# EAGLE design Coffee_Roaster_V2.0_Final_2025_02_24_A (EAGLE 9.6.1)

## Sheet 1 of 2
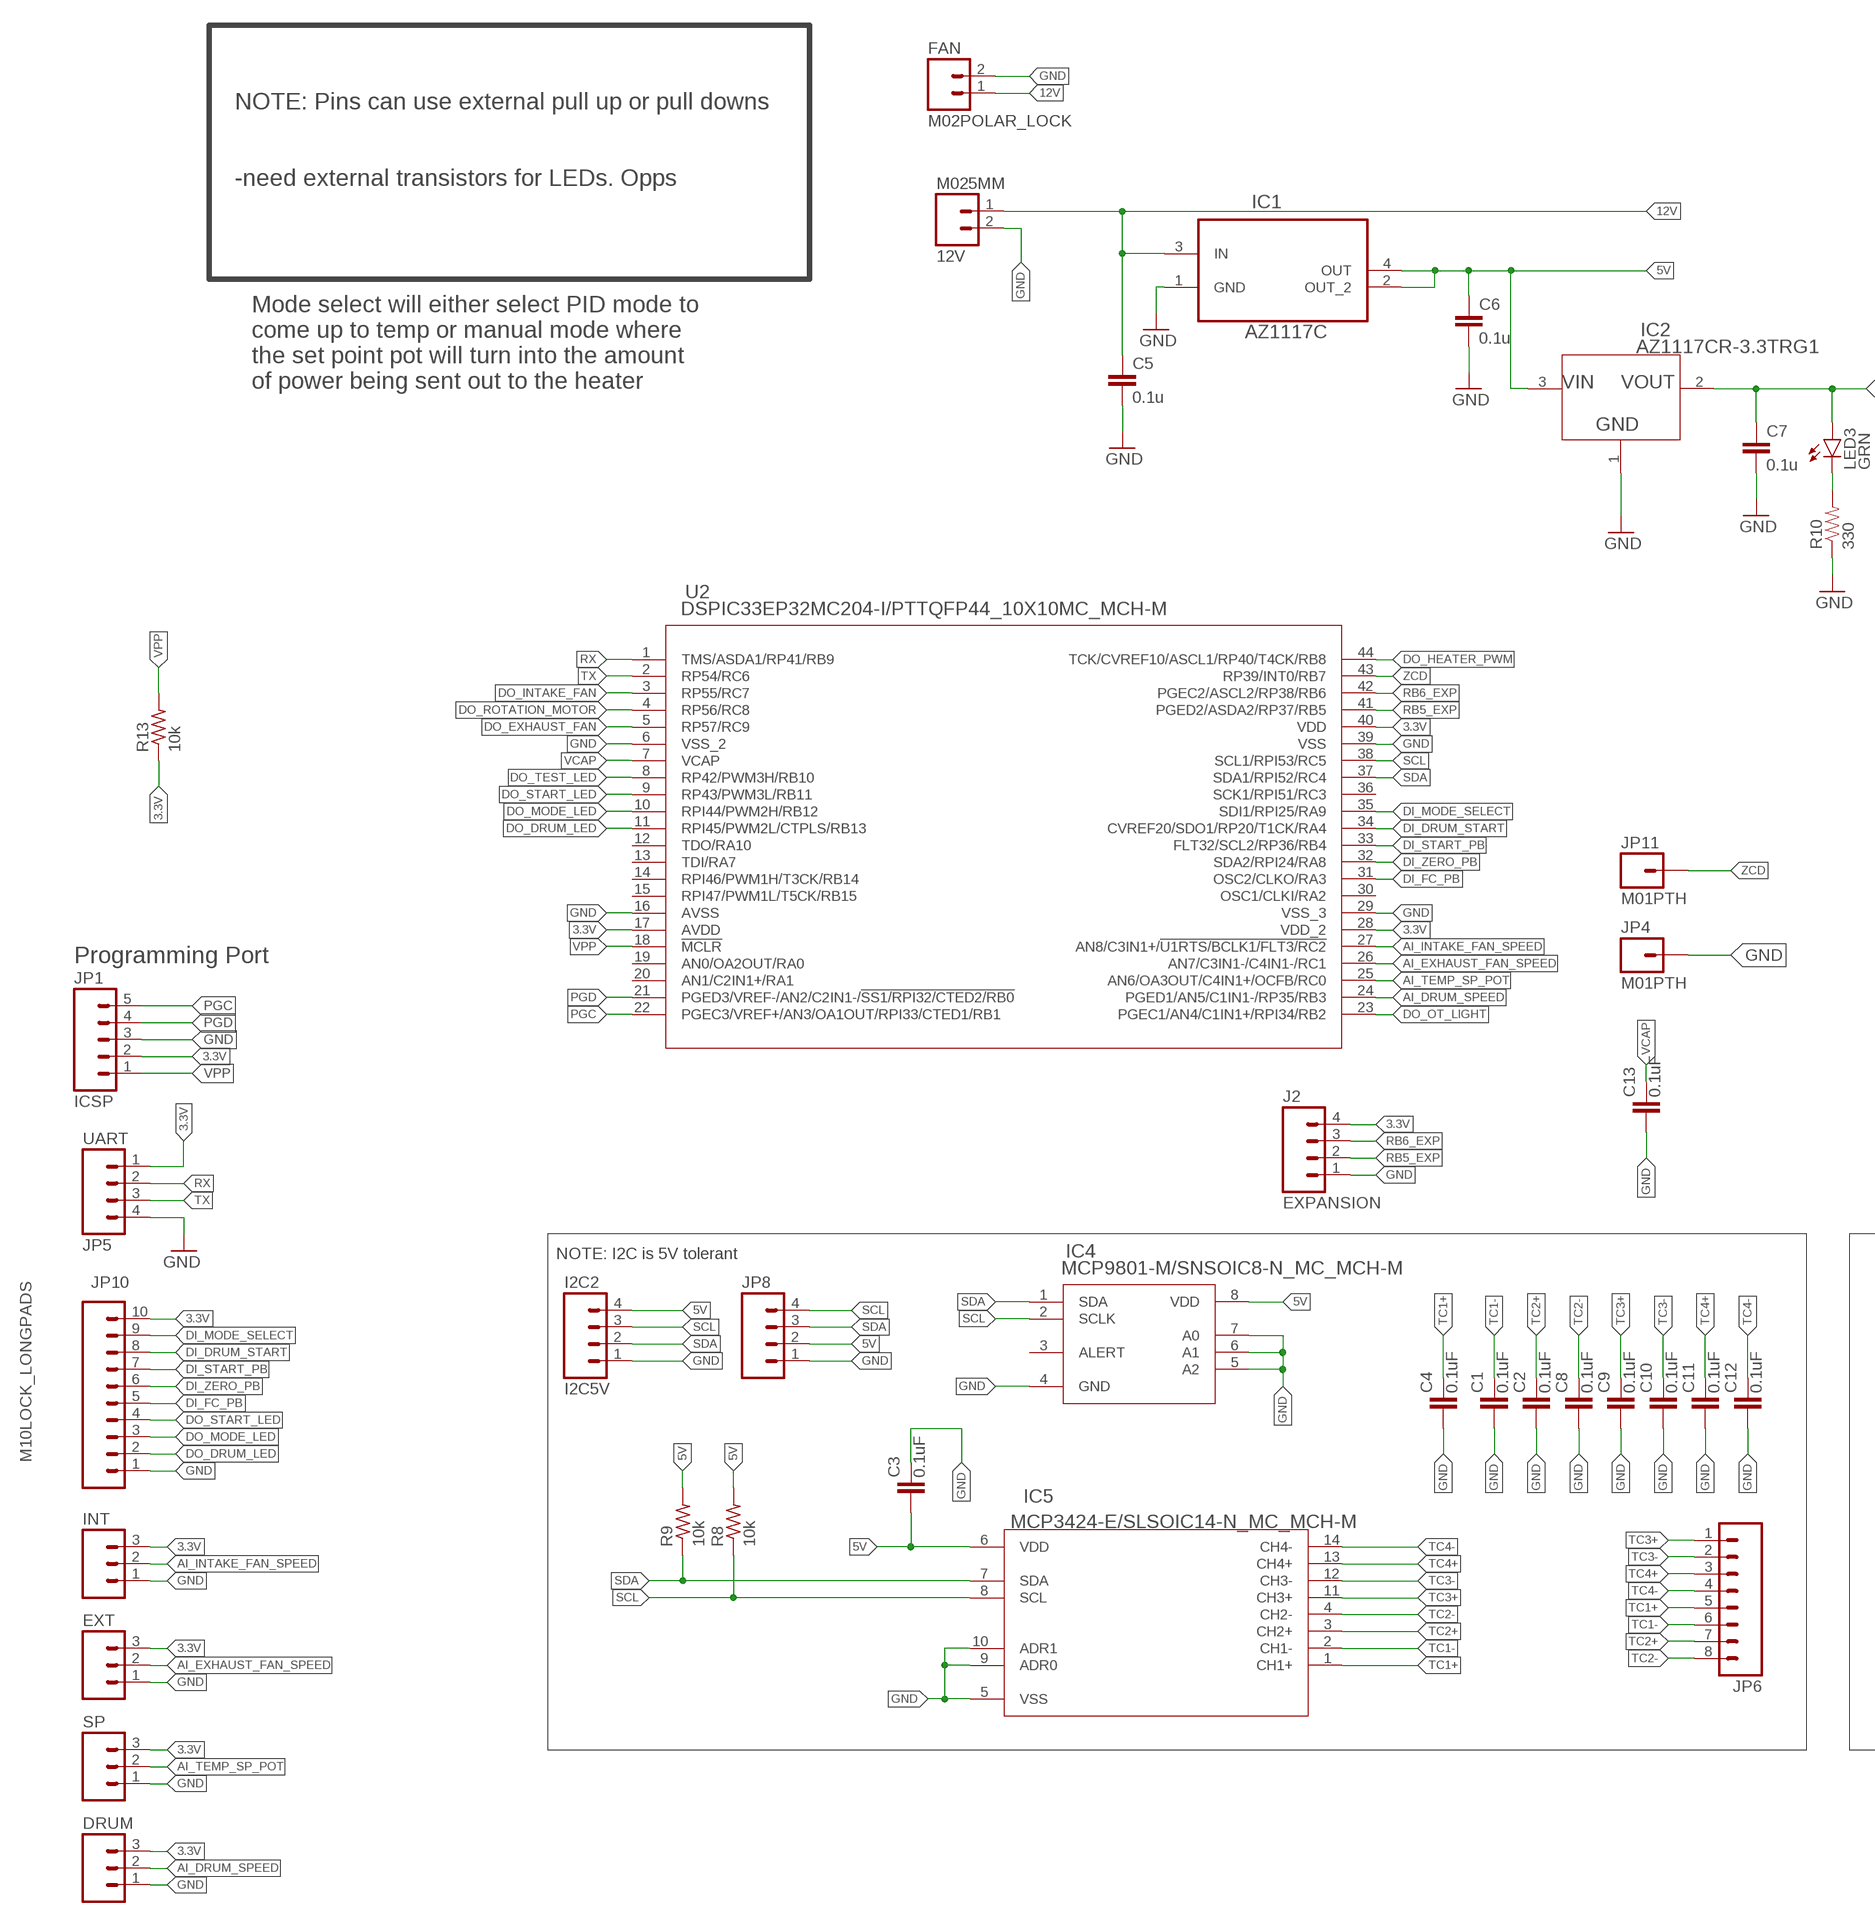
[diagram p0: schematic, sheet 1, part 1 of 2]
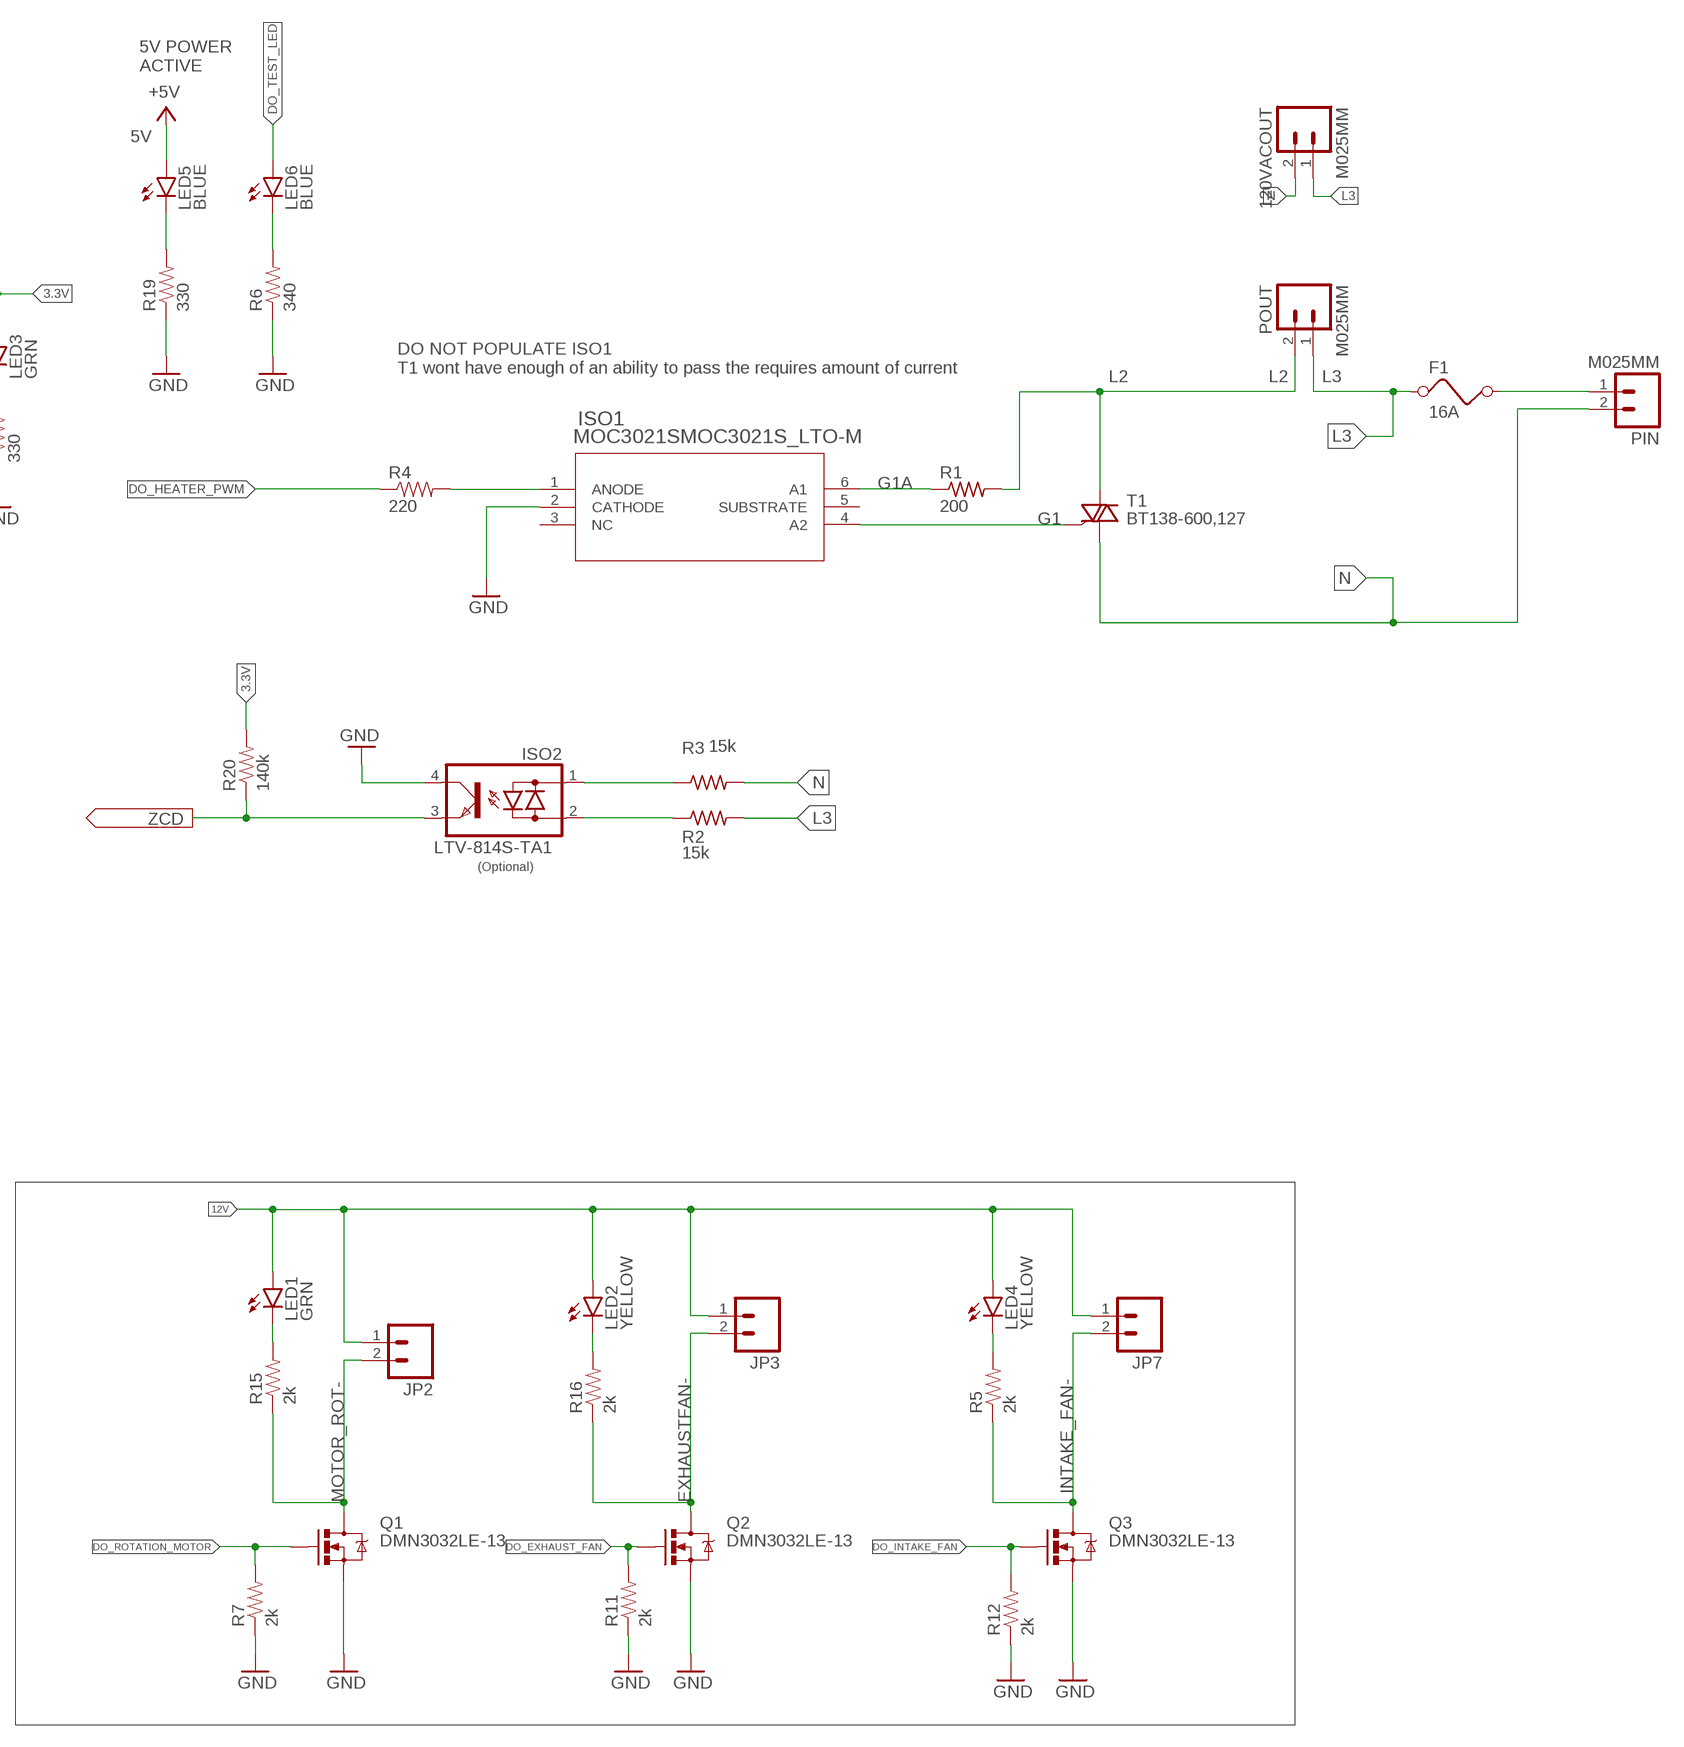
[diagram p1: schematic, sheet 1, part 2 of 2]

### Parts
12V  M025MM  [SCREWTERMINAL-5MM-2]
120VACOUT  M025MM  [SCREWTERMINAL-5MM-2]
C1  0.1uF  CAP0805  [0805]
C2  0.1uF  CAP0805  [0805]
C3  0.1uF  CAP0805  [0805]
C4  0.1uF  CAP0805  [0805]
C5  0.1u  CAP1206  [1206]
C6  0.1u  CAP1206  [1206]
C7  0.1u  CAP1206  [1206]
C8  0.1uF  CAP0805  [0805]
C9  0.1uF  CAP0805  [0805]
C10  0.1uF  CAP0805  [0805]
C11  0.1uF  CAP0805  [0805]
C12  0.1uF  CAP0805  [0805]
C13  0.1uF  CAP0805  [0805]
DRUM  M03POLAR_LOCK  [MOLEX-1X3_LOCK]
EXT  M03POLAR_LOCK  [MOLEX-1X3_LOCK]
F1  16A  FUSE  [FUSE]
FAN  M02POLAR_LOCK  [MOLEX-1X2_LOCK]
I2C2  I2C5V  M04JST  [1X04-1.5MM_JST]
IC1  AZ1117C  ADP3338AKCZ-5-R7  [SOT230P700X180-4N]
IC2  AZ1117CR-3.3TRG1  [SOT89_AZ1117_DIO]
IC4  MCP9801-M/SNSOIC8-N_MC_MCH-M  [SOIC8-N_MC_MCH-M]
IC5  MCP3424-E/SLSOIC14-N_MC_MCH-M  [SOIC14-N_MC_MCH-M]
INT  M03POLAR_LOCK  [MOLEX-1X3_LOCK]
ISO1  MOC3021SMOC3021S_LTO-M  [MOC3021S_LTO-M]
ISO2  LTV-814S-TA1  SFH6206  [DIL4-SMD]
J2  EXPANSION  M04JST  [1X04-1.5MM_JST]
JP1  ICSP  M05PTH  [1X05]
JP2  M02POLAR_LOCK  [MOLEX-1X2_LOCK]
JP3  M02POLAR_LOCK  [MOLEX-1X2_LOCK]
JP4  M01PTH  [1X01]
JP5  UART  M04LOCK  [1X04_LOCK]
JP6  M083.5MM-8  [SCREWTERMINAL-3.5MM-8]
JP7  M02POLAR_LOCK  [MOLEX-1X2_LOCK]
JP8  M04LOCK_LONGPADS  [1X04_LOCK_LONGPADS]
JP10  M10LOCK_LONGPADS  [1X10_LOCK_LONGPADS]
JP11  M01PTH  [1X01]
LED1  GRN  LED1206  [LED-1206]
LED2  YELLOW  LED1206  [LED-1206]
LED3  GRN  LED1206  [LED-1206]
LED4  YELLOW  LED1206  [LED-1206]
LED5  BLUE  LED1206  [LED-1206]
LED6  BLUE  LED1206  [LED-1206]
PIN  M025MM  [SCREWTERMINAL-5MM-2]
POUT  M025MM  [SCREWTERMINAL-5MM-2]
Q1  DMN3032LE-13  NFET_SOT_223  [SOT223]
Q2  DMN3032LE-13  NFET_SOT_223  [SOT223]
Q3  DMN3032LE-13  NFET_SOT_223  [SOT223]
R1  200  R-US_R2512  [R2512]
R2  15k  R-US_R2512  [R2512]
R3  15k  R-US_R2512  [R2512]
R4  220  RESISTOR1206  [1206]
R5  2k  RESISTOR1206  [1206]
R6  340  RESISTOR1206  [1206]
R7  2k  RESISTOR1206  [1206]
R8  10k  R-US_M0805  [M0805]
R9  10k  R-US_M0805  [M0805]
R10  330  RESISTOR1206  [1206]
R11  2k  RESISTOR1206  [1206]
R12  2k  RESISTOR1206  [1206]
R13  10k  R-US_M0805  [M0805]
R15  2k  RESISTOR1206  [1206]
R16  2k  RESISTOR1206  [1206]
R19  330  RESISTOR1206  [1206]
R20  140k  RESISTOR1206  [1206]
SP  M03POLAR_LOCK  [MOLEX-1X3_LOCK]
T1  BT138-600,127  BT138-V  [TO220BV]
U2  DSPIC33EP32MC204-I/PTTQFP44_10X10MC_MCH-M  [TQFP44_10X10MC_MCH-M]

### Nets
3.3V: C7.1 DRUM.3 EXT.3 IC2.2(OUTPUT) INT.3 J2.4 JP1.2 JP5.1 JP10.10 LED3.A R13.1 R20.2 SP.3 U2.17(AVDD) U2.28(VDD_2) U2.40(VDD)
5V: C3.1 C6.1 I2C2.4 IC1.2(OUT_2) IC1.4(OUT) IC2.3(INPUT) IC4.8(VDD) IC5.6(VDD) JP8.2 LED5.A R8.2 R9.2 ; supply symbol labelled +5V
12V: 12V.1 C5.1 FAN.1 IC1.3(IN) JP2.1 JP3.1 JP7.1 LED1.A LED2.A LED4.A
AI_DRUM_SPEED: DRUM.2 U2.24(PGED1/AN5/C1IN1-/RP35/RB3)
AI_EXHAUST_FAN_SPEED: EXT.2 U2.26(AN7/C3IN1-/C4IN1-/RC1)
AI_INTAKE_FAN_SPEED: INT.2 U2.27(AN8/C3IN1+/!U1RTS/BCLK1/FLT3/RC2)
AI_TEMP_SP_POT: SP.2 U2.25(AN6/OA3OUT/C4IN1+/OCFB/RC0)
DI_DRUM_START: JP10.8 U2.34(CVREF20/SDO1/RP20/T1CK/RA4)
DI_FC_PB: JP10.5 U2.31(OSC2/CLKO/RA3)
DI_MODE_SELECT: JP10.9 U2.35(SDI1/RPI25/RA9)
DI_START_PB: JP10.7 U2.33(FLT32/SCL2/RP36/RB4)
DI_ZERO_PB: JP10.6 U2.32(SDA2/RPI24/RA8)
DO_DRUM_LED: JP10.2 U2.11(RPI45/PWM2L/CTPLS/RB13)
DO_EXHAUST_FAN: Q2.1(G) R11.2 U2.5(RP57/RC9)
DO_HEATER_PWM: R4.1 U2.44(TCK/CVREF10/ASCL1/RP40/T4CK/RB8)
DO_INTAKE_FAN: Q3.1(G) R12.2 U2.3(RP55/RC7)
DO_MODE_LED: JP10.3 U2.10(RPI44/PWM2H/RB12)
DO_OT_LIGHT: U2.23(PGEC1/AN4/C1IN1+/RPI34/RB2)
DO_ROTATION_MOTOR: Q1.1(G) R7.2 U2.4(RP56/RC8)
DO_START_LED: JP10.4 U2.9(RP43/PWM3L/RB11)
DO_TEST_LED: LED6.A U2.8(RP42/PWM3H/RB10)
EXHAUSTFAN-: JP3.2 Q2.2(D) Q2.4(D) R16.1
G1: ISO1.4(A2) T1.G
G1A: ISO1.6(A1) R1.1
GND: 12V.2 C1.1 C2.1 C3.2 C4.1 C5.2 C6.2 C7.2 C8.1 C9.1 C10.1 C11.1 C12.1 C13.1 DRUM.1 EXT.1 FAN.2 I2C2.1 IC1.1(GND) IC2.1(ADJ/GND) IC4.4(GND) IC4.5(A2) IC4.6(A1) IC4.7(A0) IC5.5(VSS) IC5.9(ADR0) IC5.10(ADR1) INT.1 ISO1.2(CATHODE) ISO2.4(C) J2.1 JP1.3 JP4.1 JP5.4 JP8.1 JP10.1 Q1.3(S) Q2.3(S) Q3.3(S) R6.1 R7.1 R10.1 R11.1 R12.1 R19.1 SP.1 U2.6(VSS_2) U2.16(AVSS) U2.29(VSS_3) U2.39(VSS)
INTAKE_FAN-: JP7.2 Q3.2(D) Q3.4(D) R5.1
L1: F1.2 PIN.1
L2: POUT.2 R1.2 T1.T2(A2)
L3: 120VACOUT.1 F1.1 POUT.1 R2.2
MOTOR_ROT-: JP2.2 Q1.2(D) Q1.4(D) R15.1
N: 120VACOUT.2 PIN.2 R3.2 T1.T1(A1)
N$1: ISO1.1(ANODE) R4.2
N$2: LED3.C R10.2
N$3: LED1.C R15.2
N$4: LED2.C R16.2
N$6: ISO2.1(AC1) R3.1
N$7: ISO2.2(AC2) R2.1
N$8: LED4.C R5.2
N$10: LED6.C R6.2
N$13: LED5.C R19.2
PGC: JP1.5 U2.22(PGEC3/VREF+/AN3/OA1OUT/RPI33/CTED1/RB1)
PGD: JP1.4 U2.21(PGED3/VREF-/AN2/C2IN1-/!SS1/RPI32/CTED2/RB0)
RB5_EXP: J2.2 U2.41(PGED2/ASDA2/RP37/RB5)
RB6_EXP: J2.3 U2.42(PGEC2/ASCL2/RP38/RB6)
RX: JP5.2 U2.1(TMS/ASDA1/RP41/RB9)
SCL: I2C2.3 IC4.2(SCLK) IC5.8(SCL) JP8.4 R8.1 U2.38(SCL1/RPI53/RC5)
SDA: I2C2.2 IC4.1(SDA) IC5.7(SDA) JP8.3 R9.1 U2.37(SDA1/RPI52/RC4)
TC1+: C4.2 IC5.1(CH1+) JP6.5
TC1-: C1.2 IC5.2(CH1-) JP6.6
TC2+: C2.2 IC5.3(CH2+) JP6.7
TC2-: C8.2 IC5.4(CH2-) JP6.8
TC3+: C9.2 IC5.11(CH3+) JP6.1
TC3-: C10.2 IC5.12(CH3-) JP6.2
TC4+: C11.2 IC5.13(CH4+) JP6.3
TC4-: C12.2 IC5.14(CH4-) JP6.4
TX: JP5.3 U2.2(RP54/RC6)
VCAP: C13.2 U2.7(VCAP)
VPP: JP1.1 R13.2 U2.18(!MCLR)
ZCD: ISO2.3(E) JP11.1 R20.1 U2.43(RP39/INT0/RB7)
Unconnected: IC4.3(ALERT) ISO1.3(NC) ISO1.5(SUBSTRATE) U2.12(TDO/RA10) U2.13(TDI/RA7) U2.14(RPI46/PWM1H/T3CK/RB14) U2.15(RPI47/PWM1L/T5CK/RB15) U2.19(AN0/OA2OUT/RA0) U2.20(AN1/C2IN1+/RA1) U2.30(OSC1/CLKI/RA2) U2.36(SCK1/RPI51/RC3)

### Notes on the sheet
- 5V POWER
  ACTIVE
- NOTE: Pins can use external pull up or pull downs
  
  
  -need external transistors for LEDs. Opps
- Mode select will either select PID mode to
  come up to temp or manual mode where
  the set point pot will turn into the amount
  of power being sent out to the heater
- DO NOT POPULATE ISO1
  T1 wont have enough of an ability to pass the requires amount of current
- (Optional)
- Programming Port
- NOTE: I2C is 5V tolerant

## Sheet 2 of 2

## Library data of the parts
12V 120VACOUT PIN POUT = SparkFun-Connectors:M02: Standard 2-pin 0.1" header. Use with - straight break away headers ( PRT-00116) - right angle break away headers (PRT-00553) - swiss pins (PRT-00743) - machine pins (PRT-00117) - female headers (PRT-00115) Molex polarized connector foot print use with: PRT-08233 with associated crimp pins and housings. 2.54_SCREWTERM for use with PRT-10571. 3.5mm Screw Terminal footprints for PRT-08084 5mm Screw Terminal footprints for use with PRT-08432; STOREFRONT_ID: PRT-08432
C1-C4 C8-C13 = SparkFun-Capacitors:CAP: Capacitor Standard 0603 ceramic capacitor, and 0.1" leaded capacitor.
C5-C7 = SparkFun:CAP: Capacitor Standard 0603 ceramic capacitor, and 0.1" leaded capacitor.
DRUM EXT INT SP = SparkFun-Connectors:M03: Header 3 Standard 3-pin 0.1" header. Use with straight break away headers (SKU : PRT-00116), right angle break away headers (PRT-00553), swiss pins (PRT-00743), machine pins (PRT-00117), and female headers (PRT-00115). Molex polarized connector foot print use with SKU : PRT-08232 with associated crimp pins and housings.
F1 = special:FUSE: FUSE 5 x 20 mm
FAN = SparkFun-Connectors:M02: Standard 2-pin 0.1" header. Use with - straight break away headers ( PRT-00116) - right angle break away headers (PRT-00553) - swiss pins (PRT-00743) - machine pins (PRT-00117) - female headers (PRT-00115) Molex polarized connector foot print use with: PRT-08233 with associated crimp pins and housings. 2.54_SCREWTERM for use with PRT-10571. 3.5mm Screw Terminal footprints for PRT-08084 5mm Screw Terminal footprints for use with PRT-08432
I2C2 J2 JP5 JP8 = SparkFun-Connectors:M04: Header 4 Standard 4-pin 0.1" header. Use with straight break away headers (SKU : PRT-00116), right angle break away headers (PRT-00553), swiss pins (PRT-00743), machine pins (PRT-00117), and female headers (PRT-00115). Molex polarized connector foot print use with SKU : PRT-08231 with associated crimp pins and housings. 1MM SMD Version SKU: PRT-10208
IC1 = ADI-Phase-2:ADP3338AKCZ-5-R7: Low Dropout Regulator; MPN: ADP3338AKCZ-5-R7; OC_FARNELL: 1319314; OC_NEWARK: 19M8721; PACKAGE: SOT-223-3; SUPPLIER: Analog Devices
IC2 = AZ1117CR-3.3TRG1:AZ1117CR-3.3TRG1; COPYRIGHT: Copyright (C) 2022 Ultra Librarian. All rights reserved.; DIGI-KEY_PART_NUMBER_1: AZ1117CR-3.3TRG1DITR-ND; DIGI-KEY_PART_NUMBER_2: AZ1117CR-3.3TRG1DICT-ND; DIGI-KEY_PART_NUMBER_3: AZ1117CR-3.3TRG1DIDKR-ND; MANUFACTURER_PART_NUMBER: AZ1117CR-3.3TRG1; MFR_NAME: Diodes Inc
IC4 = MCP9801MSN:MCP9801-M/SN; COPYRIGHT: Copyright (C) 2023 Ultra Librarian. All rights reserved.; MANUFACTURER_PART_NUMBER: MCP9801-M/SN; MFR_NAME: Microchip
IC5 = MCP3424ESL:MCP3424-E/SL: Analog to Digital Converters - ADC 18B delta-sigma ADC dual Ch 4sps 18-Bit, 240SPS, 4-Channel ADC; COPYRIGHT: Copyright (C) 2023 Ultra Librarian. All rights reserved.; MANUFACTURER_PART_NUMBER: MCP3424-E/SL; MFR_NAME: Microchip
ISO1 = MOC3021S:MOC3021S; BUILT_BY: EMA_Cory; COPYRIGHT: Copyright (C) 2018 Accelerated Designs. All rights reserved; MANUFACTURER_PART_NUMBER: MOC3021S; SOURCELIBRARY: Lite-On_2019-12-03; VENDOR: Lite-On
ISO2 = optocoupler:SFH620: Optocoupler, Phototransistor Output, AC Input Source: http://www.vishay.com/docs/83675/sfh620.pdf; MF: VISHAY/TELEFUNKEN; MPN: SFH6206-3; OC_FARNELL: 1469585; OC_NEWARK: 58K2214
JP1 = SparkFun-Connectors:M05: Header 5 Standard 5-pin 0.1" header. Use with straight break away headers (SKU : PRT-00116), right angle break away headers (PRT-00553), swiss pins (PRT-00743), machine pins (PRT-00117), and female headers (PRT-00115). Molex polarized connector foot print use with SKU : PRT-08230 with associated crimp pins and housings.
JP2 JP3 JP7 = SparkFun:M02: Header 2 Standard 2-pin 0.1" header. Use with straight break away headers (SKU : PRT-00116), right angle break away headers (PRT-00553), swiss pins (PRT-00743), machine pins (PRT-00117), and female headers (PRT-00115). Molex polarized connector foot print use with SKU : PRT-08233 with associated crimp pins and housings.
JP4 JP11 = SparkFun-Connectors:M01: Header 1 Standard 1-pin 0.1" header. Use with straight break away headers (SKU : PRT-00116), right angle break away headers (PRT-00553), swiss pins (PRT-00743), machine pins (PRT-00117), and female headers (PRT-00115).
JP6 = SparkFun-Connectors:M08: Header 8 Standard 8-pin 0.1" header. Use with straight break away headers (SKU : PRT-00116), right angle break away headers (PRT-00553), swiss pins (PRT-00743), machine pins (PRT-00117), and female headers (PRT-00115).
JP10 = SparkFun-Connectors:M10: Header 10 Standard 10-pin 0.1" header. Use with straight break away headers (SKU : PRT-00116), right angle break away headers (PRT-00553), swiss pins (PRT-00743), machine pins (PRT-00117), and female headers (PRT-00115).
LED1-LED6 = SparkFun-LED:LED: LEDs Standard schematic elements and footprints for 5mm, 3mm, 1206, and 0603 sized LEDs. 5mm - Spark Fun Electronics SKU : COM-00529 (and others)
Q1-Q3 = NFET_LIB:NFET_SOT_223
R1-R3 = rcl:R-US_: RESISTOR, American symbol; SPICEPREFIX: R
R4-R7 R10-R12 R15 R16 R19 R20 = SparkFun-Resistors:RESISTOR: Resistor Basic schematic elements and footprints for 0603, 1206, and PTH resistors.
R8 R9 R13 = adafruit:R-US_: RESISTOR, American symbol
T1 = triac:BT138: TRIAC Source: http://www.semiconductors.philips.com BT138_SERIES_2.pdf
U2 = DSPIC33EP32MC204_TQFP:DSPIC33EP32MC204-I/PT; COPYRIGHT: Copyright (C) 2021 Ultra Librarian. All rights reserved.; MANUFACTURER_PART_NUMBER: DSPIC33EP32MC204-I/PT; MFR_NAME: Microchip

## Board
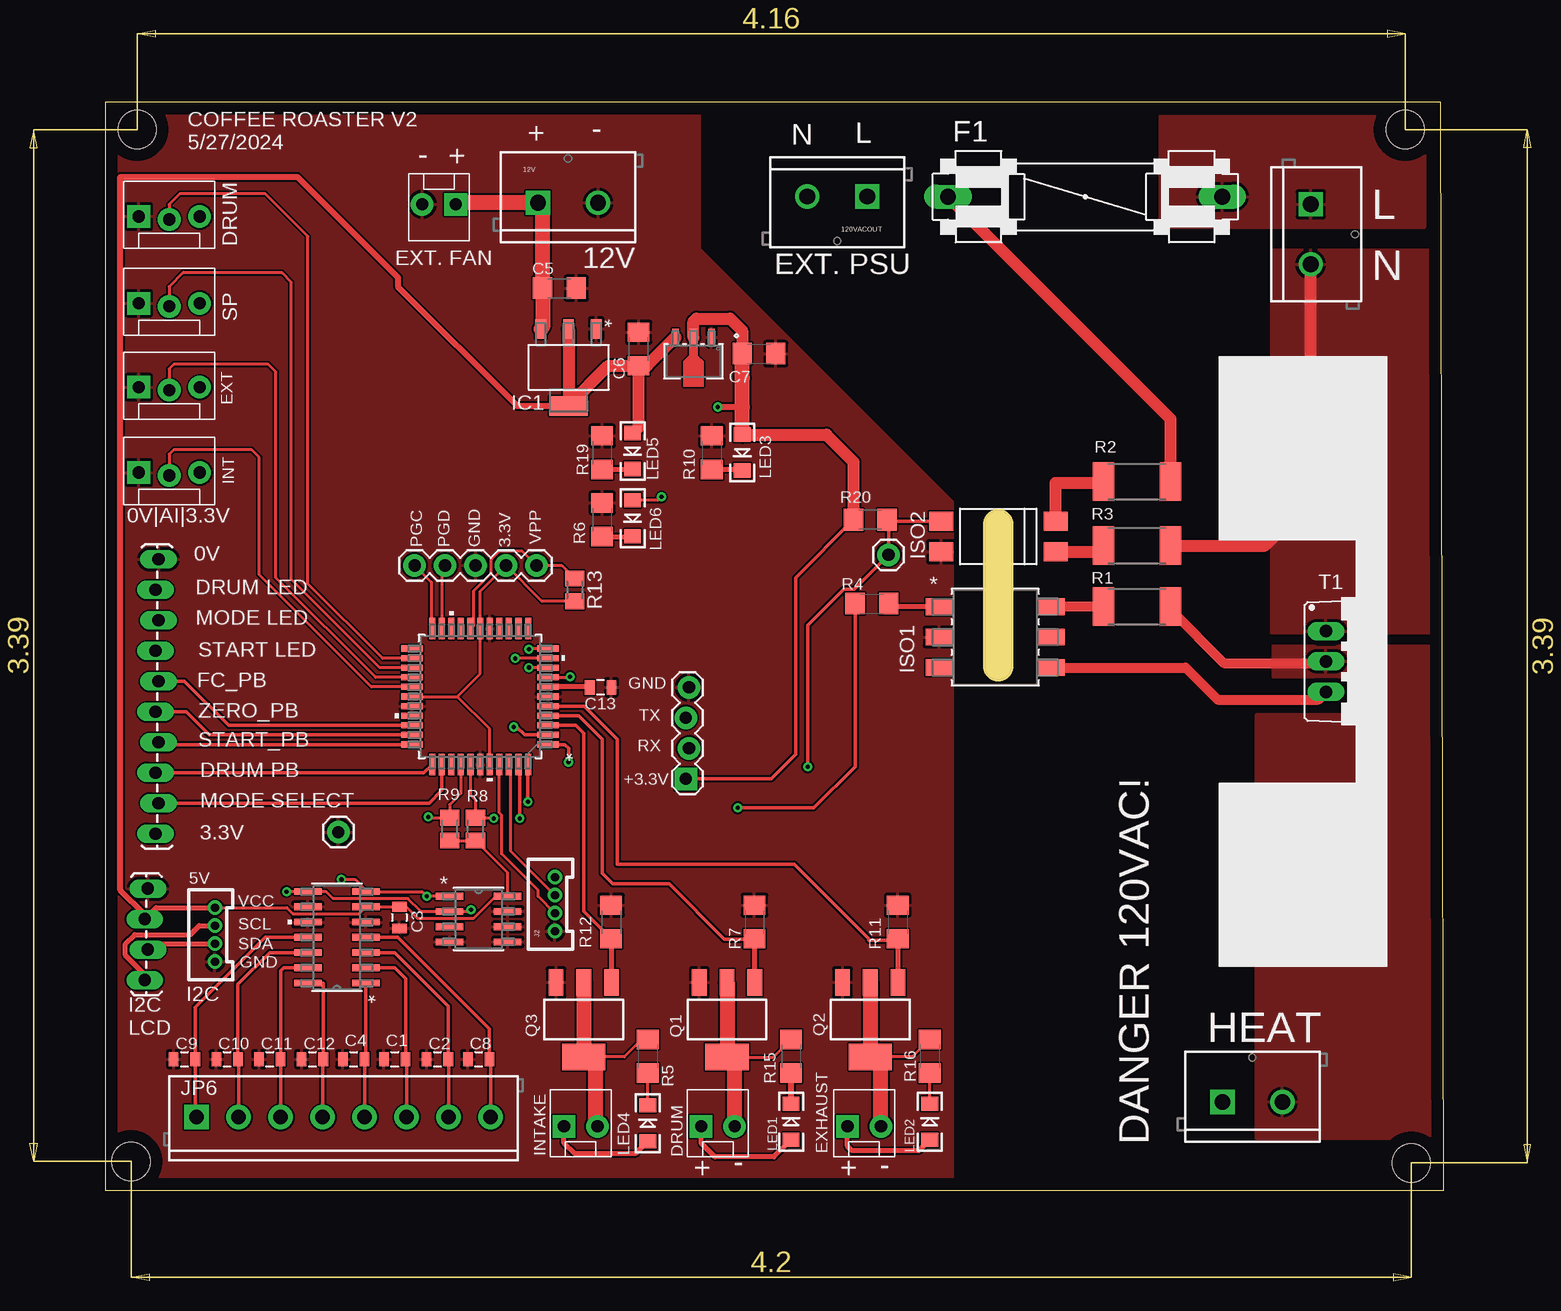
[diagram p2: board, top side]
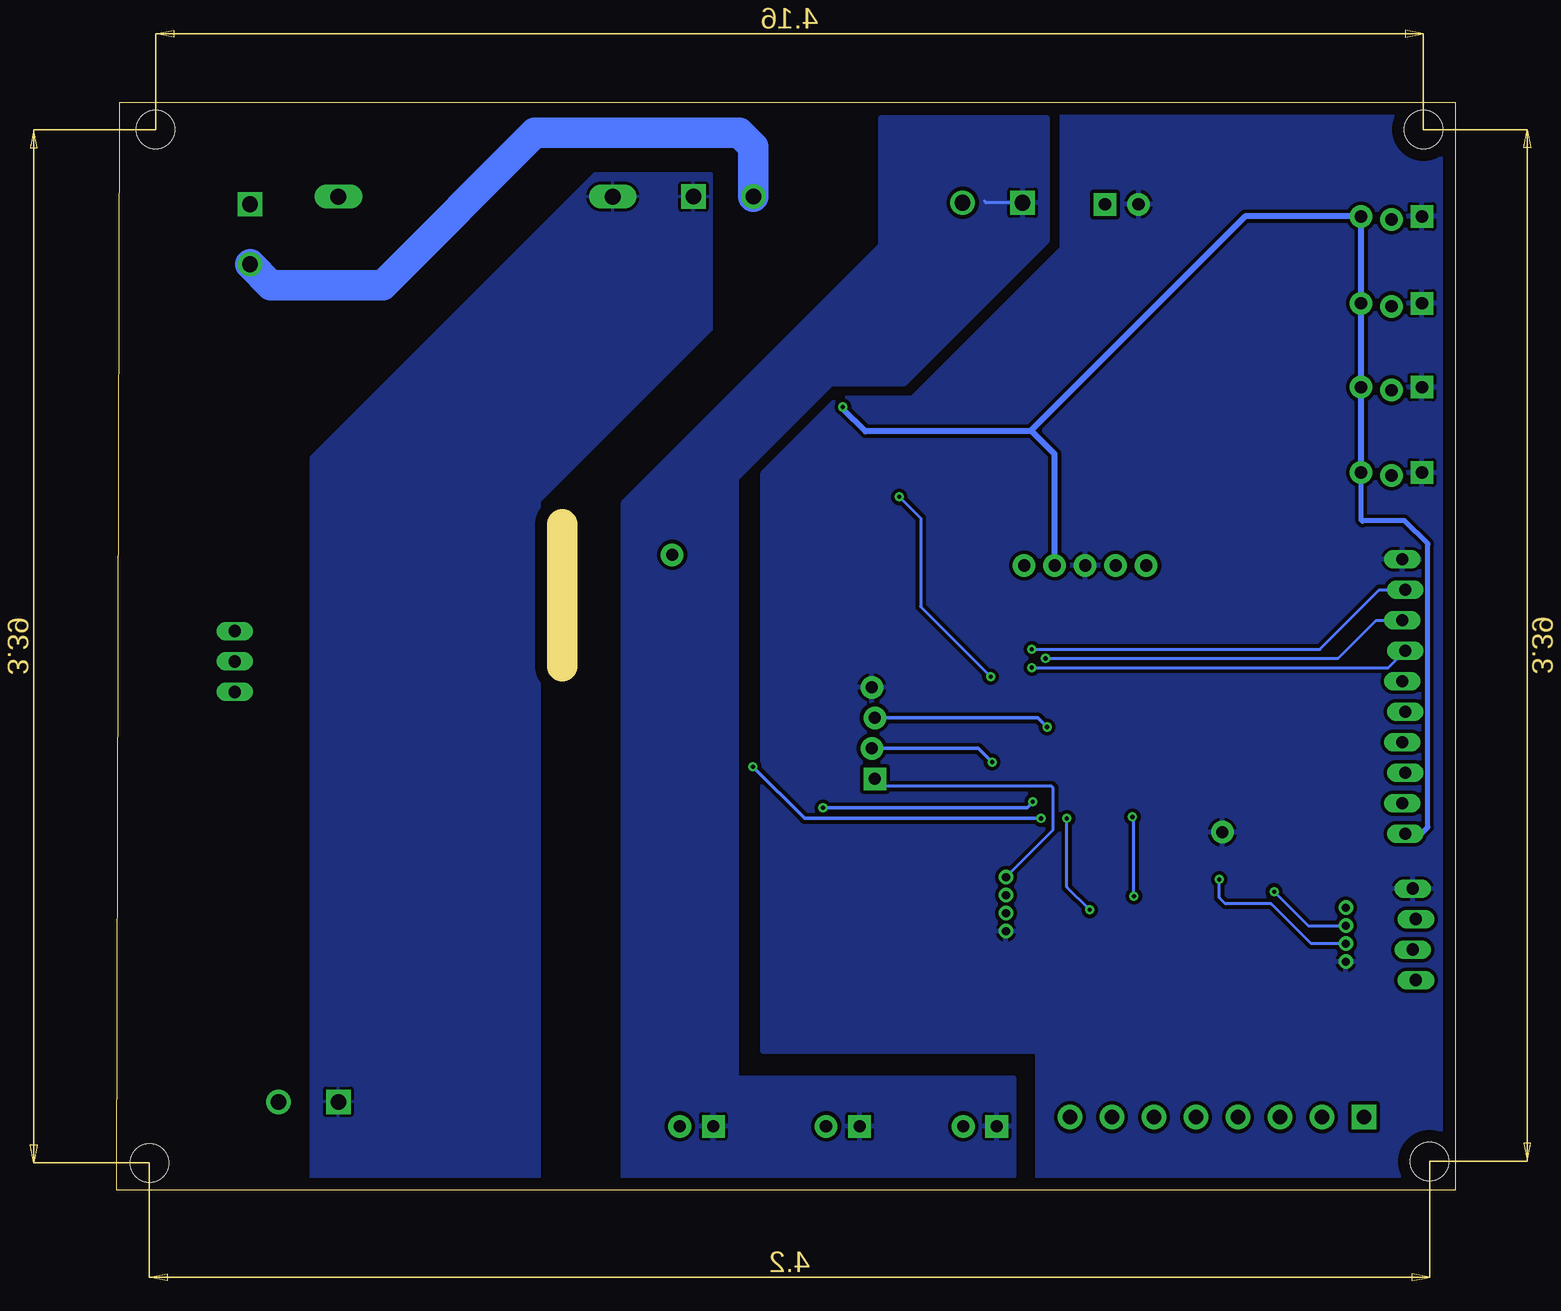
[diagram p3: board, bottom side, seen from below]

Size 111.56 x 90.67 mm. Coordinates in mm from the lower left corner, seen from the top.
Outline: 74.42,55.5 74.42,43.69
Outline: 0,0 111.56,0 111.3,90.67 0,90.67 0,0
Copper layers (1*16): Top 0.035mm / dielectric 1.5mm / Bottom 0.035mm
Design rules "default": minimum track width 10mil, minimum drill 0.35mm, track to track 6mil, track to pad 6mil, pad to pad 6mil, via to via 6mil, smd to smd 6mil, copper to edge 40mil, drill to drill 6mil, minimum pad ring 10mil, minimum via ring 8mil, stop-mask expansion 4mil, vias tented up to drill 0mil, thermal gap 10mil
Holes 3.17 mm at 2.16,2.41 108.84,2.29 108.33,88.39 2.67,88.39
tKeepout: area 72.6,3 to 76.5,57
Milling: 1 lines

### Footprints (pad centres in the part's own frame; a part is rotated, then mirrored left to right if it is on the bottom)
SCREWTERMINAL-5MM-2 = drill 1.3 pad 2.032 square: 1 0,0 | drill 1.3 pad 2.032: 2 5,0
0805 = smd 0.8 x 1.2: 1 -0.9,0; 2 0.9,0
1206 = smd 1.6 x 1.8: 1 -1.4,0; 2 1.4,0
MOLEX-1X3_LOCK = drill 1.016 pad 1.88 square: 1 0,0.127 | drill 1.016 pad 1.88: 2 2.54,-0.127; 3 5.08,0.127
FUSE = drill 1.321 long: 1 -11.43,0; 2 11.43,0
MOLEX-1X2_LOCK = drill 1.016 pad 1.88 square: 1 -0.127,0 | drill 1.016 pad 1.88: 2 2.667,0
1X04-1.5MM_JST = drill 0.7: 1 0,0; 2 1.5,0; 3 3,0; 4 4.5,0
SOT230P700X180-4N = smd 1.626 x 0.889: 1 -3.2,2.311; 2 -3.2,0; 3 -3.2,-2.311 | smd 1.626 x 3.175: 4 3.2,0
SOT89_AZ1117_DIO = smd 0.533 x 1.397: 1 -1.5,-1.994; 3 1.5,-1.994 | smd 0.61 x 1.397: 2 0,-1.994
SOIC8-N_MC_MCH-M = smd 2.286 x 0.559: 1 -2.413,1.905; 2 -2.413,0.635; 3 -2.413,-0.635; 4 -2.413,-1.905; 5 2.413,-1.905; 6 2.413,-0.635; 7 2.413,0.635; 8 2.413,1.905
SOIC14-N_MC_MCH-M = smd 2.286 x 0.559: 1 -2.413,3.81; 2 -2.413,2.54; 3 -2.413,1.27; 4 -2.413,0; 5 -2.413,-1.27; 6 -2.413,-2.54; 7 -2.413,-3.81; 8 2.413,-3.81; 9 2.413,-2.54; 10 2.413,-1.27; 11 2.413,0; 12 2.413,1.27; 13 2.413,2.54; 14 2.413,3.81
MOC3021S_LTO-M = smd 2.261 x 1.397: 1 -4.661,2.54; 2 -4.661,0; 3 -4.661,-2.54; 4 4.661,-2.54; 5 4.661,0; 6 4.661,2.54
DIL4-SMD = smd 1.6 x 2: 1 -1.27,-4.77; 2 1.27,-4.77; 3 1.27,4.77; 4 -1.27,4.77
1X05 = drill 1.016 pad 1.88: 1 0,0; 2 2.54,0; 3 5.08,0; 4 7.62,0; 5 10.16,0
1X01 = drill 1.016 pad 1.88: 1 0,0
1X04_LOCK = drill 1.016 pad 1.88 square: 1 0,0.127 | drill 1.016 pad 1.88: 2 2.54,-0.127; 3 5.08,0.127; 4 7.62,-0.127
SCREWTERMINAL-3.5MM-8 = drill 1.2 pad 2.032 square: 1 0,0 | drill 1.2 pad 2.032: 2 3.5,0; 3 7,0; 4 10.5,0; 5 14,0; 6 17.5,0; 7 21,0; 8 24.5,0
1X04_LOCK_LONGPADS = drill 1.016 long: 1 0,0; 2 2.54,-0.254; 3 5.08,0; 4 7.62,-0.254
1X10_LOCK_LONGPADS = drill 1.016 long: 1 0,0.127; 2 2.54,-0.127; 3 5.08,0.127; 4 7.62,-0.127; 5 10.16,0.127; 6 12.7,-0.127; 7 15.24,0.127; 8 17.78,-0.127; 9 20.32,0.127; 10 22.86,-0.127
LED-1206 = smd 1.2 x 1.4: A -1.5,0; C 1.5,0
SOT223 = smd 1.219 x 2.235: 1 -2.311,-3.099; 2 0,-3.099; 3 2.311,-3.099 | smd 3.6 x 2.2: 4 0,3.099
R2512 = smd 1.8 x 3.2: 1 -2.8,0; 2 2.8,0
M0805 = smd 1.3 x 1.6: 1 -0.95,0; 2 0.95,0
TO220BV = drill 1.016 long: G 2.54,-2.54; T1 -2.54,-2.54; T2 0,-2.54
TQFP44_10X10MC_MCH-M = smd 1.778 x 0.508: 1 -5.664,4; 2 -5.664,3.2; 3 -5.664,2.4; 4 -5.664,1.6; 5 -5.664,0.8; 6 -5.664,0; 7 -5.664,-0.8; 8 -5.664,-1.6; 9 -5.664,-2.4; 10 -5.664,-3.2; 11 -5.664,-4; 23 5.664,-4; 24 5.664,-3.2; 25 5.664,-2.4; 26 5.664,-1.6; 27 5.664,-0.8; 28 5.664,0; 29 5.664,0.8; 30 5.664,1.6; 31 5.664,2.4; 32 5.664,3.2; 33 5.664,4 | smd 0.508 x 1.778: 12 -4,-5.664; 13 -3.2,-5.664; 14 -2.4,-5.664; 15 -1.6,-5.664; 16 -0.8,-5.664; 17 0,-5.664; 18 0.8,-5.664; 19 1.6,-5.664; 20 2.4,-5.664; 21 3.2,-5.664; 22 4,-5.664; 34 4,5.664; 35 3.2,5.664; 36 2.4,5.664; 37 1.6,5.664; 38 0.8,5.664; 39 0,5.664; 40 -0.8,5.664; 41 -1.6,5.664; 42 -2.4,5.664; 43 -3.2,5.664; 44 -4,5.664

### Placement (x,y rotation side)
12V  36.07,82.3 0 top
120VACOUT  63.5,82.8 180 top
C1  24.13,10.92 0 top
C2  27.69,10.92 0 top
C3  24.51,22.73 270 top
C4  20.7,10.92 0 top
C5  37.85,75.18 0 top
C6  44.45,70.1 90 top
C7  54.48,69.72 0 top
C8  31.12,10.92 0 top
C9  6.6,10.92 0 top
C10  10.16,10.92 0 top
C11  13.72,10.92 0 top
C12  17.27,10.92 0 top
C13  41.27,41.91 180 top
DRUM  2.79,81.03 0 top
EXT  2.79,66.8 0 top
F1  81.66,82.8 0 top
FAN  29.08,82.17 180 top
HEATSINK  [7-345-2PP-BA]  106.81,44.07 90 top
I2C2  9.14,19.05 90 top
IC1  38.61,68.58 270 top
IC2  49.02,69.09 180 top
IC4  31.12,22.61 0 top
IC5  19.3,21.08 180 top
INT  2.79,59.69 0 top
ISO1  74.17,46.1 0 top
ISO2  74.42,54.48 90 top
J2  37.47,21.59 90 top
JP1  35.94,52.07 180 top
JP2  49.78,5.33 0 top
JP3  61.98,5.33 0 top
JP4  19.43,29.84 0 top
JP5  48.51,34.29 90 top
JP6  7.62,6.1 0 top
JP7  38.35,5.33 0 top
JP8  3.56,25.15 270 top
JP10  4.32,52.58 270 top
JP11  65.28,52.96 0 top
LED1  57.15,5.71 90 top
LED2  68.71,5.71 90 top
LED3  53.09,61.47 270 top
LED4  45.21,5.59 90 top
LED5  43.94,61.59 270 top
LED6  43.94,56.01 270 top
PIN  100.46,82.17 270 top
POUT  93.09,7.37 0 top
Q1  51.82,14.22 180 top
Q2  63.75,14.22 180 top
Q3  39.88,14.22 180 top
R1  85.98,48.64 0 top
R2  85.98,59.05 0 top
R3  85.98,53.72 0 top
R4  63.88,48.9 0 top
R5  45.21,11.18 270 top
R6  41.4,55.88 270 top
R7  54.1,22.35 270 top
R8  30.86,30.1 270 top
R9  28.7,30.1 270 top
R10  50.55,61.47 270 top
R11  66.04,22.35 270 top
R12  42.16,22.35 270 top
R13  39.12,50.04 90 top
R15  57.15,11.18 270 top
R16  68.71,11.18 270 top
R19  41.4,61.47 270 top
R20  63.75,55.88 180 top
SP  2.79,73.79 0 top
T1  104.27,44.07 270 top
U2  31.24,41.15 180 top

### Tracks (layer width: path | path; a pad name or v marks a point on that pad's centre or on a via)
3.3V  (via drill 0.35)
  Top 0.254: U2.28 29.34,41.15 | 29.34,41.15 31.24,43.05 U2.17 31.24,49.91 JP1.2 36.38,49.09 R13.1 | U2.40 32.04,38.44 29.34,41.15
  Top 0.305: JP5.1 55.5,34.29 57.53,36.32 57.53,51.06 R20.2
  Top 0.508: v51.05,65.28 53.09,65.28
  Top 1.016: IC2.2 49.02,72.39 49.28,72.64 52.07,72.64 53.08,71.63 C7.1 | LED3.A 60.09,62.97 62.35,60.71 R20.2
  Top 1.27: LED3.A 53.09,65.28 53.09,67.69 C7.1
  Bottom 0.254: J2.4 33.53,30.03 33.53,33.53 33.66,33.66 47.75,33.66 JP5.1
  Bottom 0.406: JP10.10 2.86,29.72 2.31,30.27 2.31,53.82 2.29,53.85 4.25,55.82 7.68,55.82 7.75,55.75 7.87,55.88 INT.3
  Bottom 0.508: INT.3 EXT.3 SP.3 DRUM.3 17.53,81.15 35.31,63.37 35.31,63.25 | v51.05,65.28 51.05,65.15 49.15,63.25 35.31,63.25 | JP1.2 33.4,61.34 35.31,63.25
5V
  Top 0.254: R9.2 R8.2 | R8.2 31.3,29.15 31.37,29.08 30.93,29.08 R8.2 | R8.2 33.53,26.48 IC4.8 32.55,24.51 30.72,22.68 26.02,22.68 25.07,23.63 C3.1 24.5,23.62 IC5.6 21.16,23.06 15.63,23.06 15.14,23.55 I2C2.4
  Top 0.406: JP8.2 4.25,23.55 I2C2.4
  Top 0.508: JP8.2 3.3,22.99 1.27,25.02 1.27,84.46 16,84.46 24.38,76.07 24.38,75.31 34.31,65.38 IC1.4
  Top 1.016: IC1.2 IC1.4 41.93,68.7 C6.1 | IC2.3 45.14,68.7 C6.1 | LED5.A 44.45,63.6 C6.1
12V
  Top 0.406: LED2.A 67.79,3.3 62.23,3.3 61.85,3.68 JP3.1 | LED1.A 55.73,2.79 50.8,2.79 49.66,3.94 JP2.1 | LED4.A 44.17,3.05 39.12,3.05 38.23,3.94 JP7.1
  Top 1.27: FAN.1 29.34,82.3 12V.1 36.45,81.92 C5.1 36.45,71.93 IC1.3
  Bottom 0.254: 12V.1 39.12,82.3 39.24,82.42
  Bottom 1.27: 49.53,5.21 JP2.1
  pour Bottom (isolate 0.305, rank 2): 36.83,9.4 36.83,1.14 36.96,1.02 69.22,1.02 69.34,0.89 69.34,57.28 47.88,78.74 47.88,89.41 34.04,89.41 34.04,79.12 45.97,67.18 52.07,67.18 59.94,59.31 59.94,9.4
AI_DRUM_SPEED
  Top 0.254: U2.24 25.55,44.32 23.11,44.32 16.89,50.55 16.89,79.5 13.34,83.06 6.22,83.06 5.33,82.17 DRUM.2
AI_EXHAUST_FAN_SPEED
  Top 0.254: U2.26 22.53,42.75 14.22,51.05 14.22,68.2 13.59,68.83 5.71,68.83 5.33,68.45 EXT.2
AI_INTAKE_FAN_SPEED
  Top 0.254: U2.27 22.19,41.95 12.83,51.31 12.83,61.09 12.19,61.72 5.71,61.72 5.33,61.34 INT.2
AI_TEMP_SP_POT
  Top 0.254: U2.25 22.87,43.55 15.49,50.93 15.49,75.69 14.73,76.45 6.48,76.45 5.33,75.31 SP.2
DI_DRUM_START
  Top 0.305: U2.34 26.56,34.8 JP10.8
DI_FC_PB
  Top 0.305: U2.31 10.27,38.75 6.6,42.42 JP10.5
DI_MODE_SELECT
  Top 0.305: U2.35 28.05,35.47 28.05,33.33 26.99,32.26 JP10.9
DI_START_PB
  Top 0.305: U2.33 4.63,37.15 JP10.7
DI_ZERO_PB
  Top 0.305: U2.32 8.66,37.95 6.73,39.88 JP10.6
DO_DRUM_LED  (via drill 0.35)
  Top 0.254: U2.11 35.37,45.15 v35.31,45.09
  Bottom 0.254: v35.31,45.09 11.3,45.09 6.35,50.04 JP10.2
DO_EXHAUST_FAN
  Top 0.305: U2.5 39.92,40.35 42.67,37.59 42.67,27.18 57.4,27.18 63.63,20.95 63.63,20.83 65.97,20.83 66.06,20.93
  Top 0.406: Q2.1 66.06,20.93 R11.2
DO_HEATER_PWM  (via drill 0.35)
  Top 0.254: R4.1 62.35,48.77
  Top 0.305: R4.1 62.48,35.31 59.05,31.88 v52.7,31.88 | v35.23,32.39 35.23,35.47 U2.44
  Bottom 0.305: v52.7,31.88 35.69,31.88 35.23,32.34 v35.23,32.39
DO_INTAKE_FAN
  Top 0.305: R12.2 39.88,23.24 39.88,38.1 39.23,38.75 U2.3
  Top 0.406: Q3.1 42.19,20.93 R12.2
DO_MODE_LED  (via drill 0.35)
  Top 0.254: U2.10 34.19,44.35 v34.16,44.32
  Bottom 0.254: v34.16,44.32 9.78,44.32 6.6,47.5 JP10.3
DO_ROTATION_MOTOR
  Top 0.305: U2.4 39.45,39.55 41.4,37.59 41.4,26.42 42.29,25.53 46.99,25.53 51.59,20.93 54.13,20.93
  Top 0.406: Q1.1 54.13,20.93 R7.2
DO_START_LED  (via drill 0.35)
  Top 0.254: U2.9 35.32,43.55 v35.31,43.56
  Bottom 0.254: v35.31,43.56 5.59,43.56 JP10.4
DO_TEST_LED  (via drill 0.35)
  Top 0.254: U2.8 38.68,42.75 v38.73,42.8 | v46.36,57.78 46.08,57.51 LED6.A
  Bottom 0.254: v38.73,42.8 44.58,48.64 44.58,56.01 v46.36,57.78
EXHAUSTFAN-
  Top 0.254: R16.1 67.26,11.12 Q2.4
  Top 1.27: JP3.2 64.64,10.24 Q2.4 Q2.2
G1
  Top 0.813: ISO1.4 90.04,43.56 92.71,40.89 101.09,40.89 T1.G
G1A
  Top 0.813: R1.1 ISO1.6
GND
  pour Top: -5.84,90.93 49.53,90.93 49.53,78.49 70.61,57.4 70.61,-0.76 -8.38,-0.76 -8.64,-1.02 -8.64,88.14
  pour Bottom (isolate 0.305): 32.77,91.06 -0.38,91.06 -0.89,90.55 -0.89,-1.4 -0.64,-1.65 34.8,-1.65 34.8,11.56 57.72,11.56 57.72,59.75 51.44,66.04 45.21,66.04 32.77,78.49
INTAKE_FAN-
  Top 0.254: R5.1 44.7,12.58 43.25,11.12 40.89,11.12 Q3.4
  Top 1.27: JP7.2 40.89,5.46 40.89,11.12 | Q3.2 Q3.4
L1
  pour Top (isolate 0.406): 87.88,80.26 109.98,80.26 109.98,89.79 87.88,89.79
L2
  Top 0.813: R1.2 88.78,48.38 93.22,43.94 101.6,43.94 T1.T2
  pour Top (isolate 0.406): 110.62,45.34 97.28,45.34 97.28,42.8 104.27,42.8 104.27,39.62 95.89,39.62 95.89,4.32 110.62,4.32
L3
  Top 1.016: R2.2 88.78,64.26 F1.1
  pour Bottom (isolate 0.61): 95.38,61.09 95.38,-0.38 76.33,-0.38 76.33,57.4 61.98,71.75 61.98,84.71 71.75,84.71
MOTOR_ROT-
  Top 0.254: R15.1 55.63,11.05 52.07,11.05 51.89,11.05
  Top 1.27: JP2.2 52.45,10.67 52.07,11.05 | Q1.2 Q1.4 51.89,11.05
N
  Top 1.016: R3.2 96.65,53.72 100.46,57.53 PIN.2
  Bottom 2.54: 120VACOUT.2 58.5,86.95 59.69,88.14 76.71,88.14 89.41,75.44 98.73,75.44 PIN.2
  pour Top (isolate 0.813): 97.16,46.48 111.25,46.48 111.25,78.36 97.16,78.36
N$1
  Top 0.406: ISO1.1 65.53,48.64 R4.2
N$2
  Top 0.254: 50.45,59.97 R10.2
  Top 0.406: R10.2 52.99,60.07 LED3.C
N$3
  Top 0.508: LED1.C R15.2
N$4
  Top 0.254: LED2.C R16.2
N$6
  Top 1.016: ISO2.1 82.67,53.21 R3.1
N$7
  Top 1.016: ISO2.2 79.19,58.93 83.05,58.93 R2.1
N$8
  Top 0.254: LED4.C R5.2
N$10
  Top 0.406: R6.2 43.91,54.48 LED6.C
N$13
  Top 0.406: R19.2 41.43,60.09 LED5.C
  Top 0.508: LED5.C 43.89,60.09 43.79,60.2
PGC
  Top 0.254: JP1.5 27.18,50.67 27.18,46.88 U2.22
PGD
  Top 0.254: JP1.4 28.04,51.79 U2.21
RB5_EXP
  Top 0.254: J2.2 36.07,24.49 36.07,25.02 33.04,28.04 33.04,31.26 32.84,31.46 U2.41
RB6_EXP
  Top 0.254: J2.3 33.78,28.27 33.78,35.34 U2.42
RX  (via drill 0.35)
  Top 0.305: v38.61,35.69 38.61,36.83 38.29,37.15 U2.1
  Bottom 0.305: JP5.2 39.75,36.83 v38.61,35.69
SCL  (via drill 0.35)
  Top 0.254: U2.38 30.44,32.93 30.86,32.51 R8.1 30.92,30.99 v32.38,30.99 | v30.48,23.37 30.35,23.24 IC4.2 26.3,23.24 25.23,24.31 19,24.31 18.41,24.89 IC5.8 v15.11,24.89
  Top 0.406: I2C2.3 7.83,22.05 7.09,21.31 2.46,21.31 1.68,20.53 1.68,19.6 3.3,17.98 JP8.4
  Bottom 0.254: v30.48,23.37 32.38,25.27 v32.38,30.99 | v15.11,24.89 12.27,22.05 I2C2.3
SDA  (via drill 0.35)
  Top 0.254: U2.37 29.64,33.07 28.7,32.13 R9.1 26.99,31.05 v26.92,31.11 | IC4.1 v26.8,24.51 26.42,24.89 21.84,24.89 | IC5.7 21.84,24.89 | v19.68,25.91 20.83,25.91 21.84,24.89
  Top 0.406: JP8.3 4.04,20.55 I2C2.2
  Bottom 0.254: v26.8,24.51 26.8,30.99 v26.92,31.11 | I2C2.2 12.04,20.55 15.37,23.88 19.18,23.88 19.68,24.38 v19.68,25.91
TC1+
  Top 0.305: IC5.1 21.72,11.04 C4.2 21.62,10.9 JP6.5
TC1-
  Top 0.305: IC5.2 24.13,18.54 25.03,17.64 C1.2 25.12,10.83 JP6.6
TC2+
  Top 0.305: IC5.3 24.13,19.81 28.59,15.36 C2.2 28.62,10.89 JP6.7
TC2-
  Top 0.305: JP6.8 32.12,10.82 C8.2 32.02,13.45 24.38,21.08 IC5.4
TC3+
  Top 0.305: IC5.11 13.34,21.08 7.5,15.25 C9.2 7.5,6.21 JP6.1
TC3-
  Top 0.305: C10.2 11.06,11.18 | 11.06,11.18 11.06,17.16 13.72,19.81 IC5.12 | JP6.2 11.12,11.12 11.06,11.18
TC4+
  Top 0.305: IC5.13 14.86,18.54 14.62,18.3 C11.2 JP6.3
TC4-
  Top 0.305: IC5.14 18.17,17.27 C12.2 18.12,10.87 JP6.4
TX  (via drill 0.35)
  Top 0.305: v34.04,38.61 34.29,38.61 34.95,37.95 U2.2
  Bottom 0.305: JP5.3 34.8,39.37 v34.04,38.61
VCAP
  Top 0.406: C13.2 40.49,41.95 U2.7
VPP
  Top 0.254: U2.18 30.71,47.08 30.71,49.95 32.18,51.43 32.18,52.58 32.9,53.29 34.72,53.29 JP1.1 38.03,52.07 R13.2
ZCD  (via drill 0.35)
  Top 0.305: ISO2.3 65.28,55.75 R20.1 65.28,55.76 JP11.1 62.42,50.1 61.55,50.1 58.55,47.09 v58.55,35.31 | v34.54,30.99 34.54,35.38 U2.43
  Bottom 0.305: v58.55,35.31 54.23,30.99 v34.54,30.99

### Text on the board
tPlace: - | COFFEE ROASTER V2 / 5/27/2024 | + | N | L | - | + | EXT. FAN | 12V | EXT. PSU | 0V|AI|3.3V | 0V | DRUM LED | MODE LED | START LED | FC_PB | ZERO_PB | START_PB | DRUM PB | MODE SELECT | 3.3V | 5V | VCC | SCL | SDA | GND | I2C | I2C / LCD
tNames: L | N | PGC | PGD | GND | 3.3V | VPP | GND | TX | RX | +3.3V | HEAT | EXHAUST | INTAKE | DRUM | DANGER 120VAC! | + | - | + | -
tValues: LINE